# Altium schematic sheet STM32F103C8T6.SchDoc
size A4; SheetNumber: 6; SheetTotal: 6
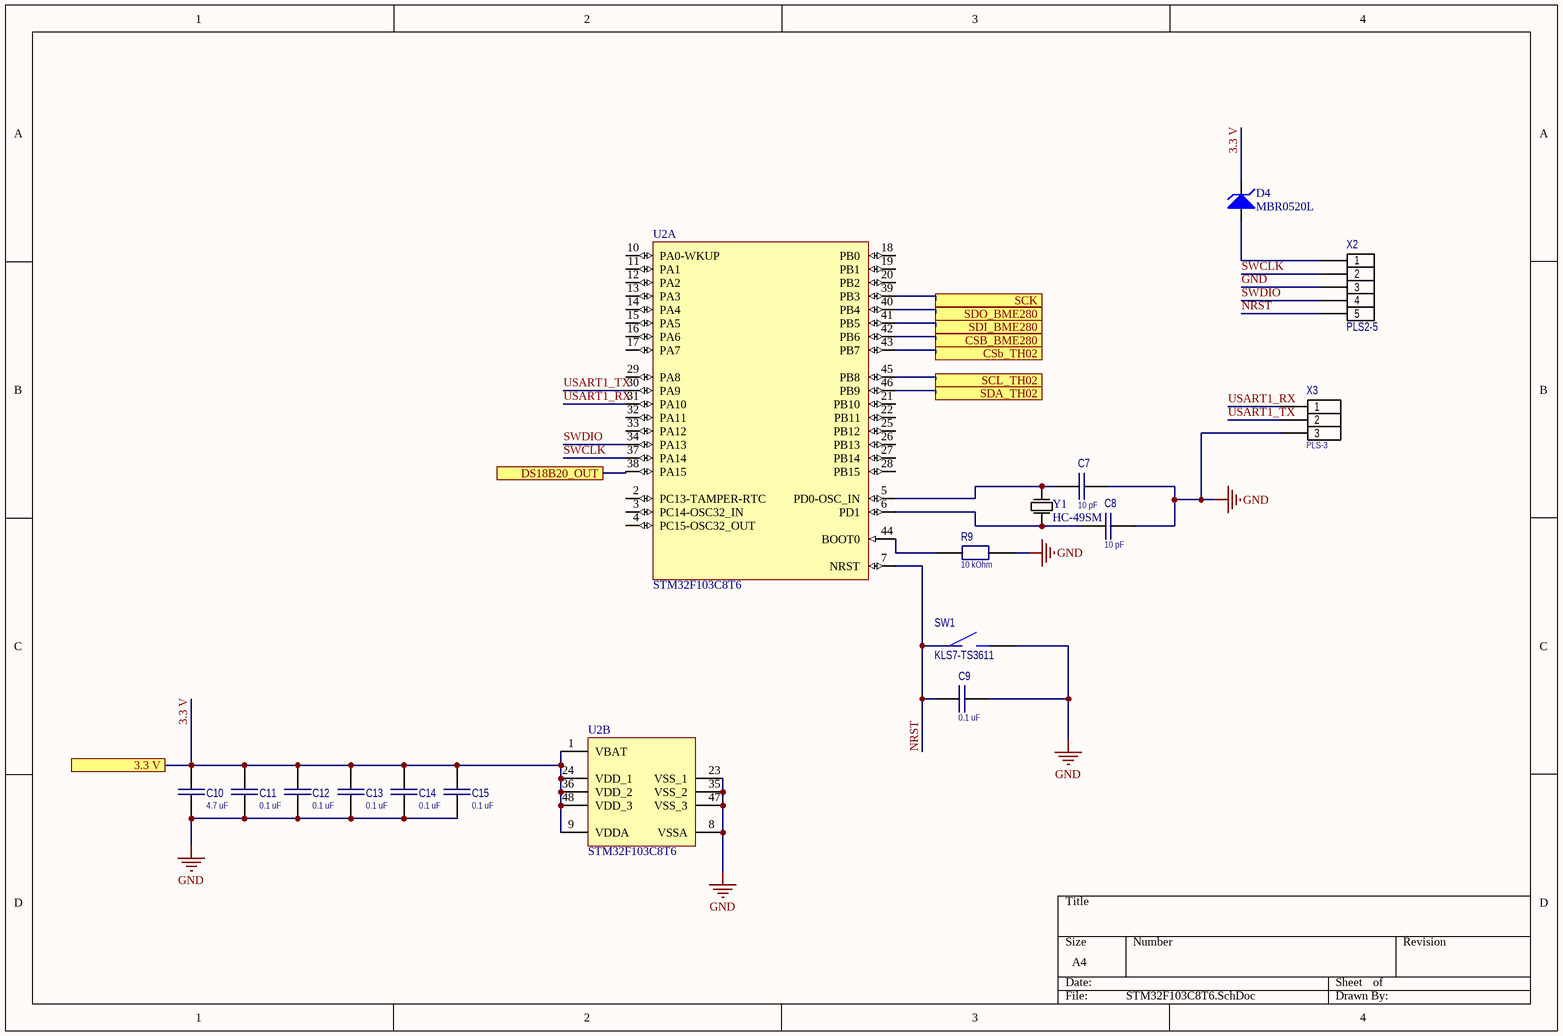
[diagram p0: STM32F103C8T6.SchDoc]

## Parts
C7  10 pF  [C_0805]
C8  10 pF  [C_0805]
C9  0.1 uF  [C_0805]
C10  4.7 uF  [C_0805]
C11  0.1 uF  [C_0805]
C12  0.1 uF  [C_0805]
C13  0.1 uF  [C_0805]
C14  0.1 uF  [C_0805]
C15  0.1 uF  [C_0805]
D4  MBR0520L  [SOD-123]
R9  10 kOhm  [R_0805]
SW1  KLS7-TS3611  [KLS7-TS3611]
U2  STM32F103C8T6  [LQFP48_N]  (parts A,B of 2)
X2  PLS2-5  [PLS-5-2]
X3  PLS-3  [PLS-3-3D]
Y1  HC-49SM  [HC-49SM]

## Ports
3.3 V (see MainSheet[2A], BME280[2B], DC-DC_MC34063[1B], DS18B20[2C], TH02[1B]), CSB_BME280 (see MainSheet[2B], BME280[3B]), CSb_TH02 (see MainSheet[3B], TH02[1C]), DS18B20_OUT (see MainSheet[3B], DS18B20[1B]), SCK (see MainSheet[2B], BME280[3B]), SCL_TH02 (see MainSheet[3B], TH02[1B]), SDA_TH02 (see MainSheet[3B], TH02[1B]), SDI_BME280 (see MainSheet[2B], BME280[3B]), SDO_BME280 (see MainSheet[2B], BME280[1B])

## Nets
GND: C7.1 C8.1 C9.1 C10.1 C11.1 C12.1 C13.1 C14.1 C15.1 R9.1 SW1.2 U2.8(VSSA) U2.23(VSS_1) U2.35(VSS_2) U2.47(VSS_3) X2.3 X3.3
3.3 V: C10.2 C11.2 C12.2 C13.2 C14.2 C15.2 D4.2(K) U2.1(VBAT) U2.9(VDDA) U2.24(VDD_1) U2.36(VDD_2) U2.48(VDD_3) ; port 3.3 V
CSB_BME280: U2.42(PB6) ; port CSB_BME280
CSb_TH02: U2.43(PB7) ; port CSb_TH02
DS18B20_OUT: U2.38(PA15) ; port DS18B20_OUT
NRST: C9.2 SW1.1 U2.7(NRST) X2.5
SCK: U2.39(PB3) ; port SCK
SCL_TH02: U2.45(PB8) ; port SCL_TH02
SDA_TH02: U2.46(PB9) ; port SDA_TH02
SDI_BME280: U2.41(PB5) ; port SDI_BME280
SDO_BME280: U2.40(PB4) ; port SDO_BME280
SWCLK: U2.37(PA14) X2.2
SWDIO: U2.34(PA13) X2.4
USART1_RX: U2.31(PA10) X3.1
USART1_TX: U2.30(PA9) X3.2
NetC7_2: C7.2 U2.5(PD0-OSC_IN) Y1.2(OSC2)
NetC8_2: C8.2 U2.6(PD1) Y1.1(OSC1)
NetD4_1: D4.1(A) X2.1
NetR9_2: R9.2 U2.44(BOOT0)

Not connected (* = marked no-connect by the designer): U2 2(PC13-TAMPER-RTC) 3(PC14-OSC32_IN) 4(PC15-OSC32_OUT) 10(PA0-WKUP) 11(PA1) 12(PA2) 13(PA3) 14(PA4) 15(PA5) 16(PA6) 17(PA7) 18(PB0) 19(PB1) 20(PB2) 21(PB10) 22(PB11) 25(PB12) 26(PB13) 27(PB14) 28(PB15) 29(PA8) 32(PA11) 33(PA12)

## Library data of the parts
C7-C15 = C0805: Capacitor
  C7 C8: Value: 10 pF
  C9 C11-C15: Value: 0.1 uF
  C10: Value: 4.7 uF
D4 = DZ_SOD123: Surface Mount Zener Diode; Published: 8-Jun-2000; LatestRevisionDate: 17-Jul-2002; LatestRevisionNote: Re-released for DXP Platform.; DatasheetDocument: REV. L-2; PackageReference: SOD-123; Publisher: Altium Limited; ComponentLink1Description: Manufacturer Link; ComponentLink1URL: http://www.vishay.com/
R9 = R0805: Resistor; Value: 10 kOhm
SW1 = button
X2 = PLS2-5: Header, 5-Pin; LatestRevisionDate: 17-Jul-2002; LatestRevisionNote: Re-released for DXP Platform.; Publisher: Altium Limited
X3 = PLS-3: Header, 3-Pin; LatestRevisionDate: 17-Jul-2002; LatestRevisionNote: Re-released for DXP Platform.; Publisher: Altium Limited
U2 = STM32F103C8T6: DatasheetVersion: rev13.0, Apr-2011; PackageVersion: rev13, Apr-2011; PackageReference: LQFP48; PackageDescription: 48-Pin Low-Profile Quad Flat Pack, 7 x 7 mm Body, 0.5 mm Pitch (LQFP48); ComponentLink1Description: Manufacturer URL; ComponentLink1URL: http://www.st.com/; ComponentLink2Description: STM32F103 Datasheet; ComponentLink2URL: http://www.st.com/internet/com/TECHNICAL_RESOURCES/TECHNICAL_LITERATURE/DATASHEET/CD00161566.pdf; ComponentLink3Description: STM32 Family Web Page; ComponentLink3URL: www.st.com/stm32